# EAGLE design Accumulator Indicator Light r1 (EAGLE 6.5.0)
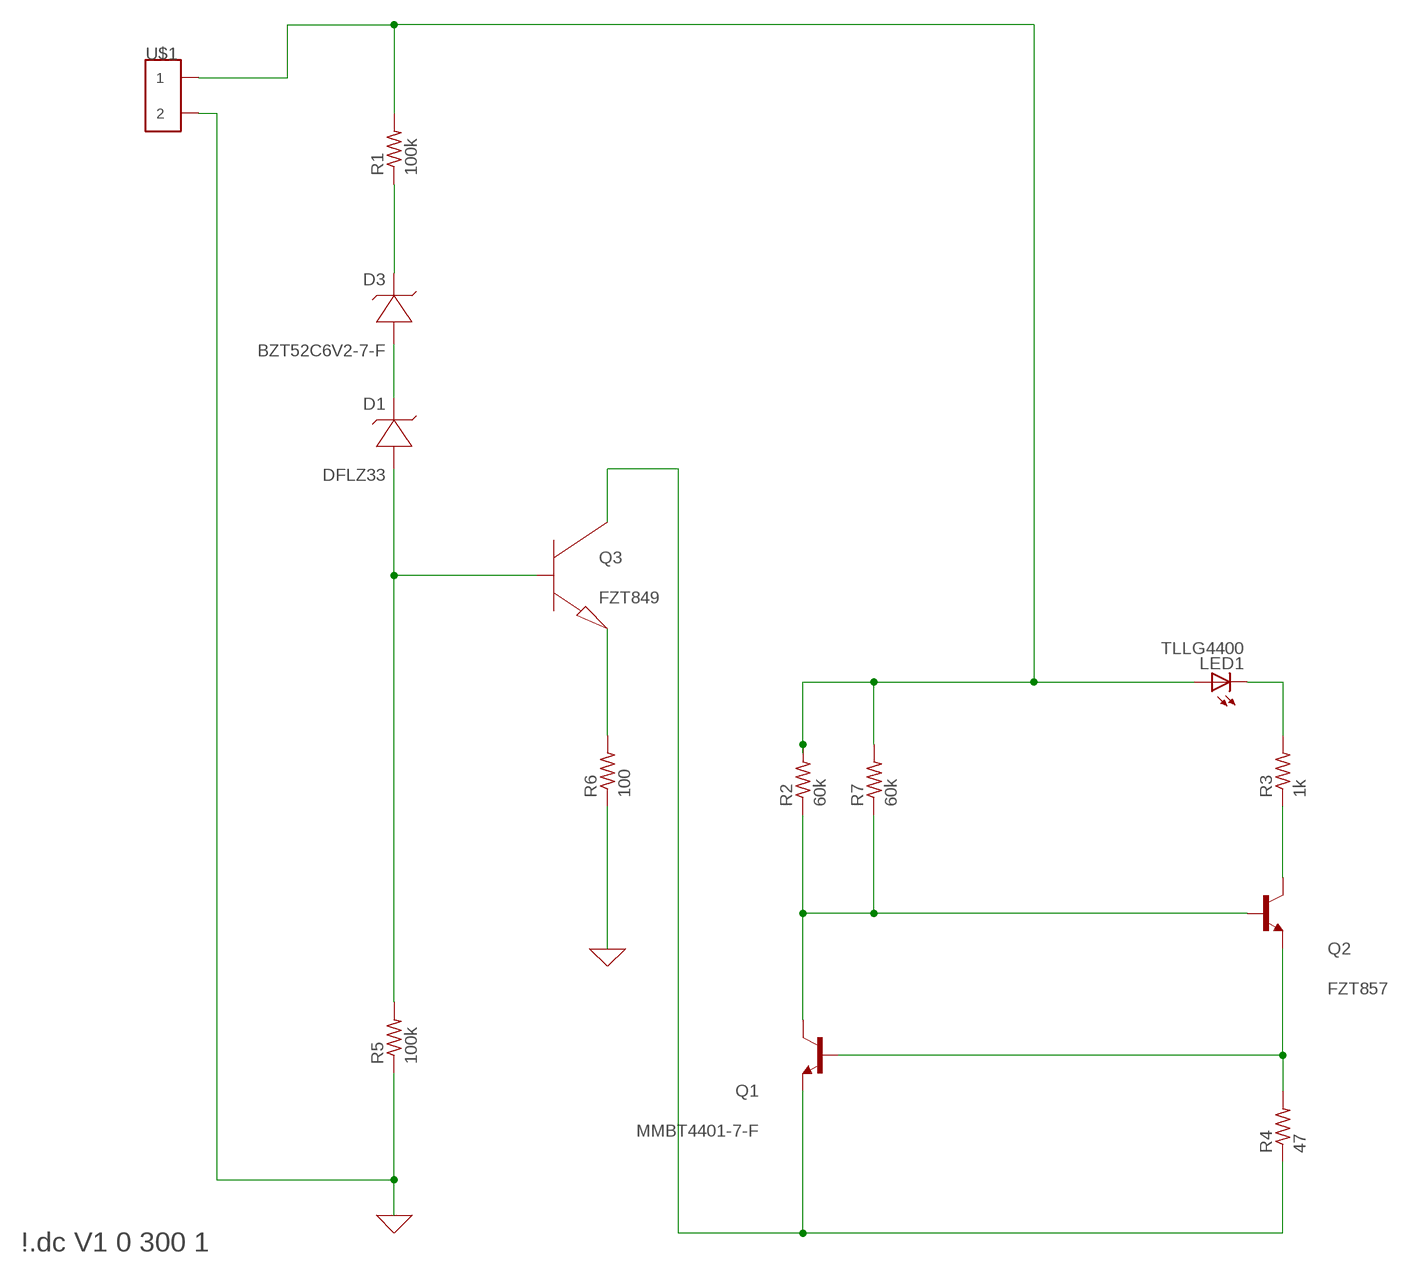
[diagram p0: schematic, sheet 1]

## Parts
D1  DFLZ33  ZENER  [SOD123]
D3  BZT52C6V2-7-F  ZENER  [SOD123]
LED1  TLLG4400  [LED3MM]
Q1  MMBT4401-7-F  [SOT-23-3]
Q2  FZT857  [SOT223]
Q3  FZT849  NPN  [SOT23]
R1  100k  R-US_0411/15  [0411/15]
R2  60k  R-US_0411/15  [0411/15]
R3  1k  R-US_R0603  [R0603]
R4  47  R-US_R0603  [R0603]
R5  100k  R-US_R0603  [R0603]
R6  100  R-US_R0603  [R0603]
R7  60k  R-US_0411/15  [0411/15]
U$1  CONN_2  [CONNECTOR_2]

## Nets
0: R5.1 R6.1 U$1.3 U$1.4
B1: D1.A(+) Q3.2(B) R5.2
B2: Q1.P$1(C) Q2.1(B) R2.1 R7.1
C1: Q1.P$3(E) Q3.3(C) R4.1
C2: Q2.2(C) Q2.4(C) R3.1
E1: Q3.1(E) R6.2
E2: Q1.P$2(B) Q2.3(E) R4.2
N$3: D1.C(-) D3.A(+)
N$5: LED1.K(C) R3.2
N$6: LED1.A R1.2 R2.2 R7.2 U$1.1 U$1.2
R1: D3.C(-) R1.1

## Notes on the sheet
- \!.dc V1 0 300 1

## Library data of the parts
D1 D3 = sym:ZENER: Zener Diode; SPICETYPE: diode; SPICE_DESCRIPTION: Diode
LED1 = led:TLLG4400: Low Current (2mA) LED 3 mm Tinted Diffused Package color GREEN Source: Data sheet <http://www.farnell.com/datasheets/391098.pdf>; MF: VISHAY SEMICONDUCTOR; OC_FARNELL: 1612435
Q1 = formula electric:MMBT4401-7-F
Q2 = formula electric:FZT857: FZT857CT-ND
Q3 = sym:NPN: Bipolar NPN transistor
R1 R2 R7 = rcl:R-US_: RESISTOR, American symbol
R3-R6 = resistor:R-US_: RESISTOR, American symbol
U$1 = formula electric:CONN_2

## Board
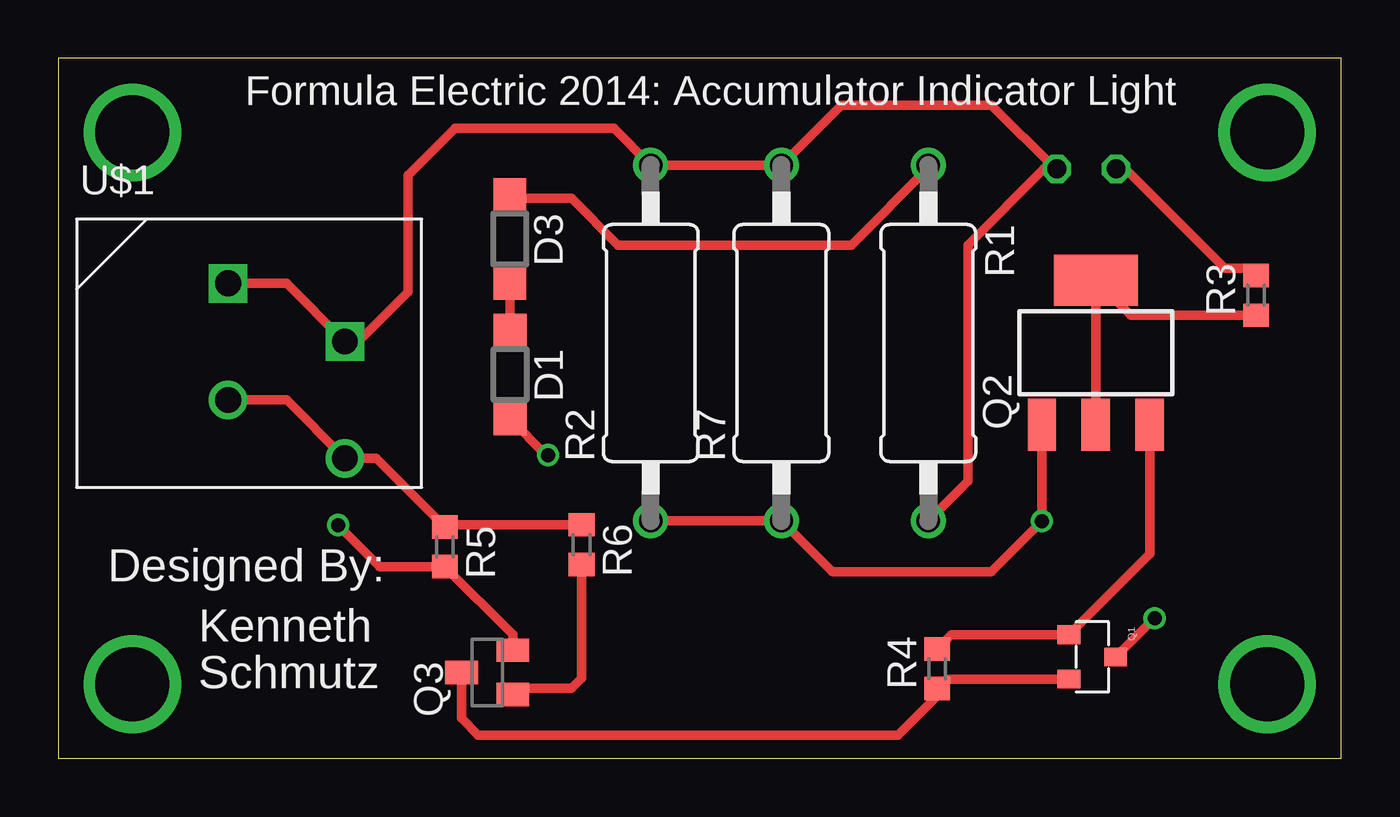
[diagram p1: board, top side]
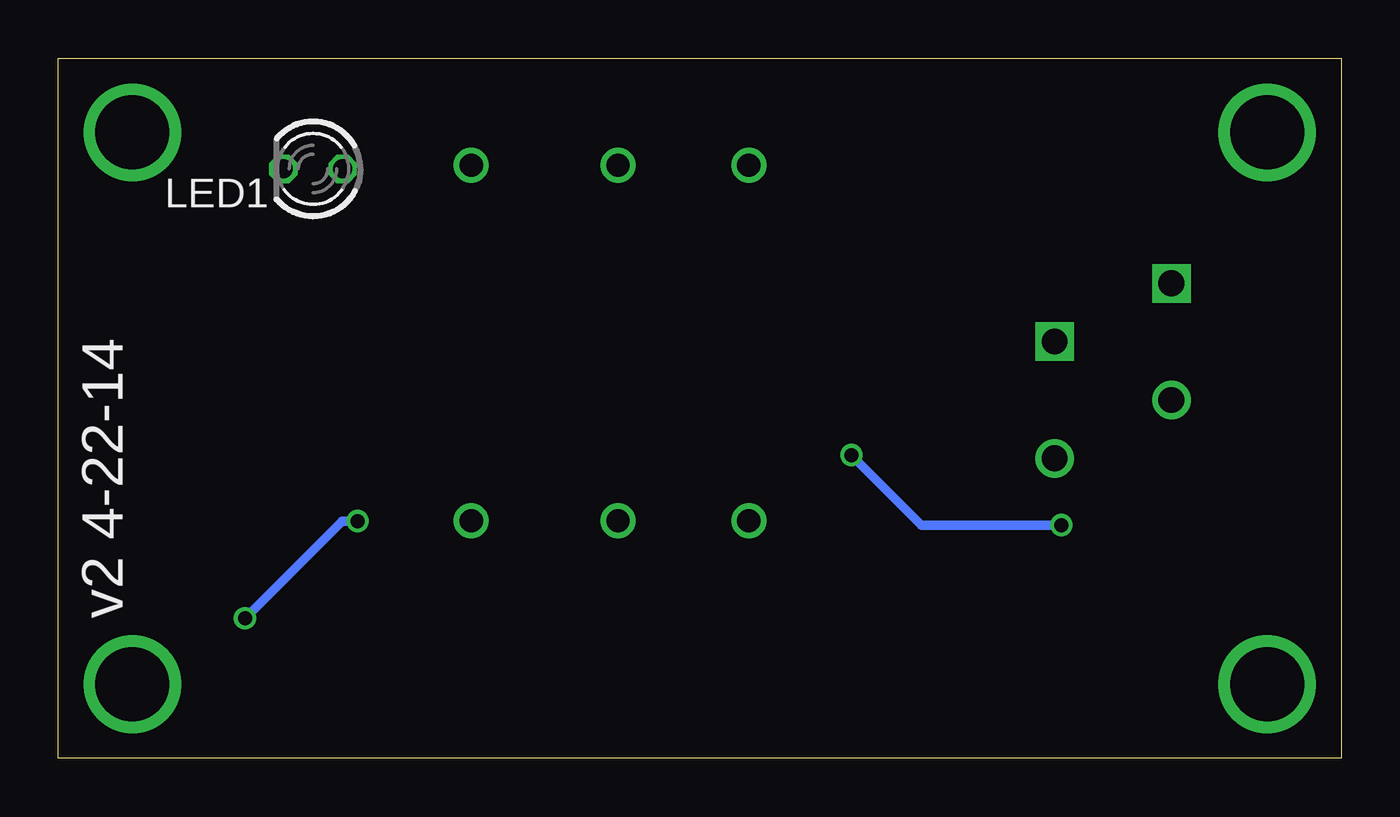
[diagram p2: board, bottom side, seen from below]

Size 55 x 30 mm. Coordinates in mm from the lower left corner, seen from the top.
Outline: 0,0 55,0 55,30 0,30 0,0
Copper layers (1*16): Top 0.0356mm / dielectric 1.5011mm / Bottom 0.0356mm
Design rules "OshPark DRC": minimum track width 6mil, minimum drill 13mil, track to track 6mil, track to pad 6mil, pad to pad 6mil, via to via 6mil, smd to smd 6mil, copper to edge 15mil, drill to drill 6mil, minimum pad ring 7mil, minimum via ring 7mil, stop-mask expansion 3mil, vias tented up to drill 0mil, thermal gap 10mil

### Footprints (pad centres in the part's own frame; a part is rotated, then mirrored left to right if it is on the bottom)
SOD123 = smd 1.4 x 1.4: A 1.9,0; C -1.9,0
LED3MM = drill 0.813 octagon: A -1.27,0; K 1.27,0
SOT-23-3 = smd 0.8 x 0.976: P$1 0,1; P$2 -0.95,-1; P$3 0.95,-1
SOT223 = smd 1.219 x 2.235: 1 -2.311,-3.099; 2 0,-3.099; 3 2.311,-3.099 | smd 3.6 x 2.2: 4 0,3.099
SOT23 = smd 1 x 1.4: 1 -0.95,-1.1; 2 0.95,-1.1; 3 0,1.1
0411/15 = drill 1: 1 -7.62,0; 2 7.62,0
R0603 = smd 1 x 1.1: 1 -0.85,0; 2 0.85,0
CONNECTOR_2 = drill 1.1 square: 1 0,0; 2 2.5,5 | drill 1.1: 3 5,0; 4 7.5,5

### Placement (x,y rotation side)
D1  19.37,16.45 270 top
D3  19.36,22.26 270 top
LED1  44.08,25.26 180 bottom
Q1  44.33,4.35 270 top
Q2  44.48,17.39 0 top
Q3  18.39,3.68 90 top
R1  37.3,17.8 270 top
R2  25.4,17.8 90 top
R3  51.35,19.84 90 top
R4  37.68,3.84 90 top
R5  16.57,9.07 270 top
R6  22.43,9.16 270 top
R7  31,17.8 90 top
U$1  7.28,20.36 270 top

### Tracks (layer width: path | path; a pad name or v marks a point on that pad's centre or on a via)
0
  Top 0.406: U$1.3 9.78,15.36 U$1.4 13.63,12.86 R5.1 16.66,10.01 R6.1
B1  (via drill 0.6)
  Top 0.406: Q3.2 19.49,5.3 R5.2 13.78,8.22 v12,10 | D1.A 20.92,13 v21,13
  Bottom 0.406: v21,13 18,10 v12,10
B2  (via drill 0.6)
  Top 0.406: R2.1 R7.1 33.18,8 40,8 42,10 v42.17,10.17 Q2.1 | Q1.P$1 46.98,6 v47,6
  Bottom 0.406: v47,6 42.83,10.17 v42.17,10.17
C1
  Top 0.406: Q3.3 17.29,1.71 18,1 36,1 37.68,2.68 R4.1 38.09,3.4 Q1.P$3
C2
  Top 0.406: R3.1 45.98,18.99 Q2.4 Q2.2
E1
  Top 0.406: Q3.1 19.76,3 22,3 22.43,3.43 R6.2
E2
  Top 0.406: R4.2 38.29,5.3 Q1.P$2 46.79,8.76 Q2.3
N$2  (via drill 3.17)
  other vias: 3.17,3.17
N$3
  Top 0.406: D1.C D3.A
N$4  (via drill 3.17)
  other vias: 3.17,26.82
N$5
  Top 0.406: R3.2 51.04,21 50,21 45.74,25.26 LED1.K
N$6
  Top 0.406: U$1.1 9.78,20.36 U$1.2 12.86,17.86 15,20 15,25 17,27 23.82,27 R2.2 R7.2 33.58,28 40,28 42.74,25.26 | R1.2 39,11.88 39,22 42.26,25.26 42.74,25.26 | LED1.A 42.74,25.26
N$11  (via drill 3.17)
  other vias: 51.83,26.82
N$12  (via drill 3.17)
  other vias: 51.83,3.17
R1
  Top 0.406: D3.C 19.52,24 22,24 24,22 34,22 37.3,25.3 R1.1

### Text on the board
tNames: Formula Electric 2014: Accumulator Indicator Light | Designed By: | Kenneth | Schmutz
bNames: v2 4-22-14